# EAGLE design RockSat_PCB (EAGLE 9.6.2)
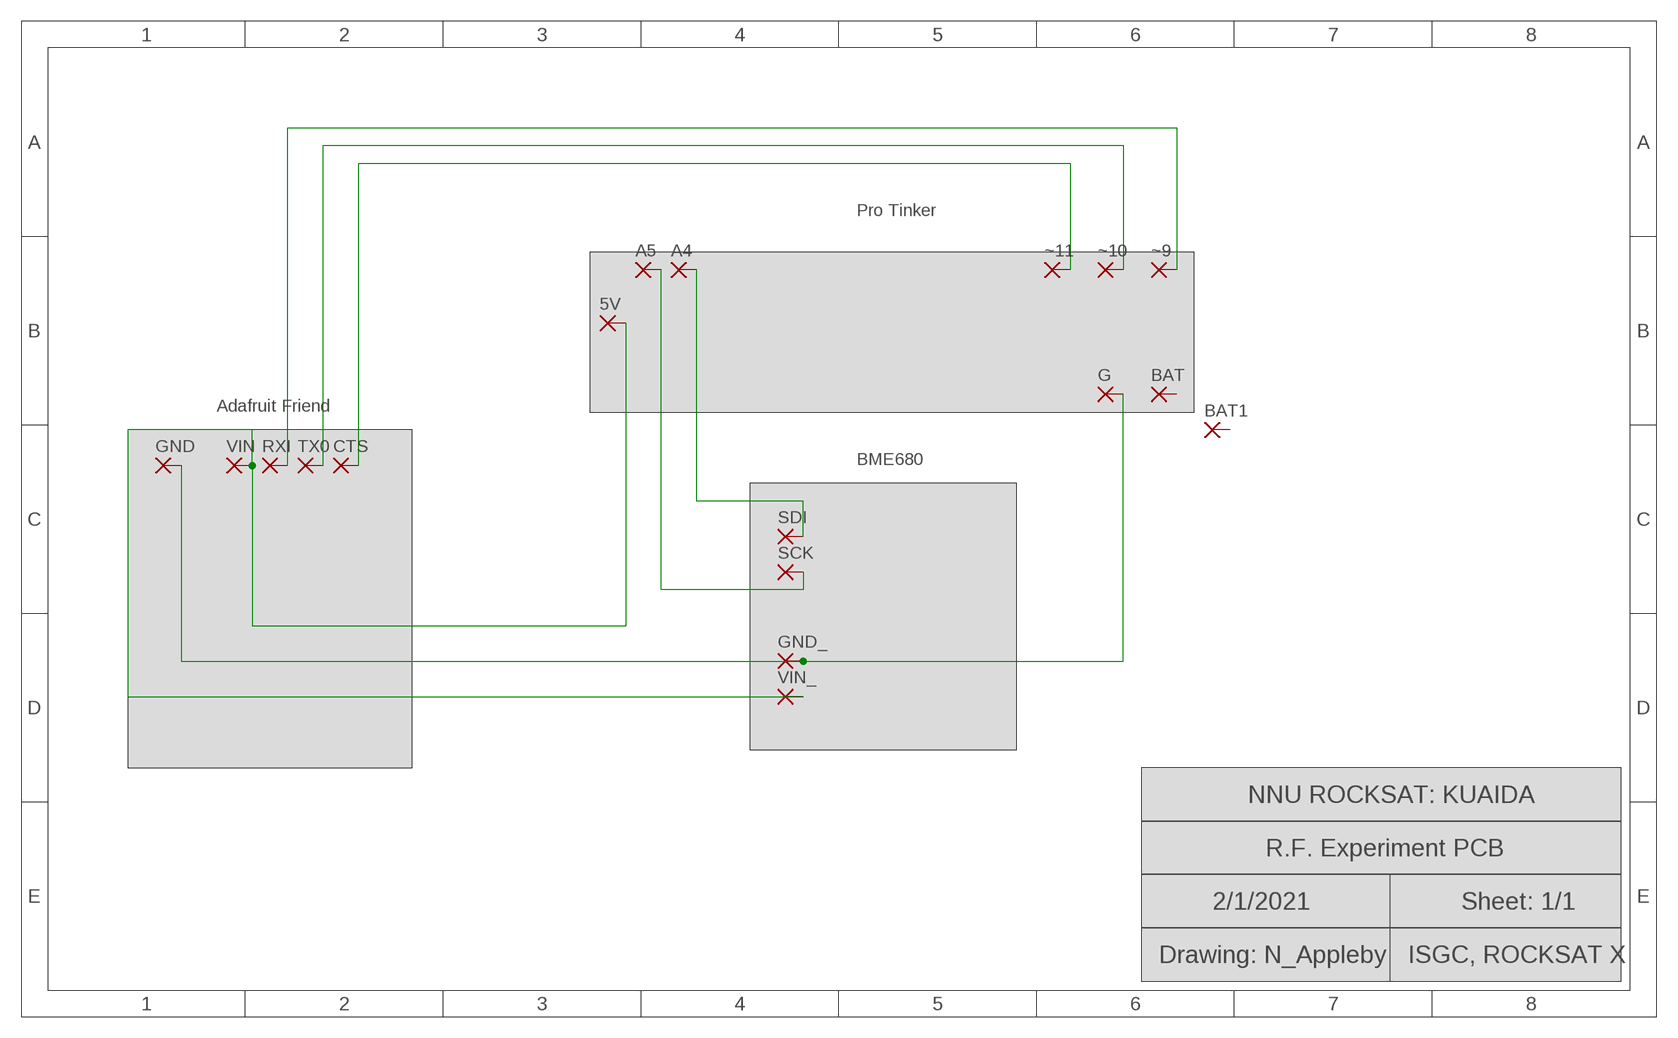
[diagram p0: schematic, sheet 1]

## Parts
5V  1,6/0,9  [1,6/0,9]
A4  1,6/0,9  [1,6/0,9]
A5  1,6/0,9  [1,6/0,9]
BAT  1,6/0,9  [1,6/0,9]
BAT1  1,6/0,9  [1,6/0,9]
CTS  1,6/0,9  [1,6/0,9]
G  1,6/0,9  [1,6/0,9]
GND  1,6/0,9  [1,6/0,9]
GND_  1,6/0,9  [1,6/0,9]
RXI  1,6/0,9  [1,6/0,9]
SCK  1,6/0,9  [1,6/0,9]
SDI  1,6/0,9  [1,6/0,9]
TX0  1,6/0,9  [1,6/0,9]
VIN  1,6/0,9  [1,6/0,9]
VIN_  1,6/0,9  [1,6/0,9]
~9  1,6/0,9  [1,6/0,9]
~10  1,6/0,9  [1,6/0,9]
~11  1,6/0,9  [1,6/0,9]

## Nets
N$1: G.1(P) GND.1(P) GND_.1(P)
N$2: 5V.1(P) VIN.1(P) VIN_.1(P)
N$3: A5.1(P) SCK.1(P)
N$4: RXI.1(P) ~9.1(P)
N$5: TX0.1(P) ~10.1(P)
N$6: CTS.1(P) ~11.1(P)
N$7: A4.1(P) SDI.1(P)
Unconnected: BAT1.1(P) BAT.1(P)

## Notes on the sheet
- Pro Tinker
- Adafruit Friend
- BME680
- NNU ROCKSAT: KUAIDA
- R.F. Experiment PCB
- 2/1/2021 | Sheet: 1/1
- Drawing: N_Appleby | ISGC, ROCKSAT X

## Library data of the parts
5V A4 A5 BAT BAT1 CTS G GND GND_ RXI SCK SDI TX0 VIN VIN_ ~9-~11 = wirepad:1,6/0,9: THROUGH-HOLE PAD

## Board
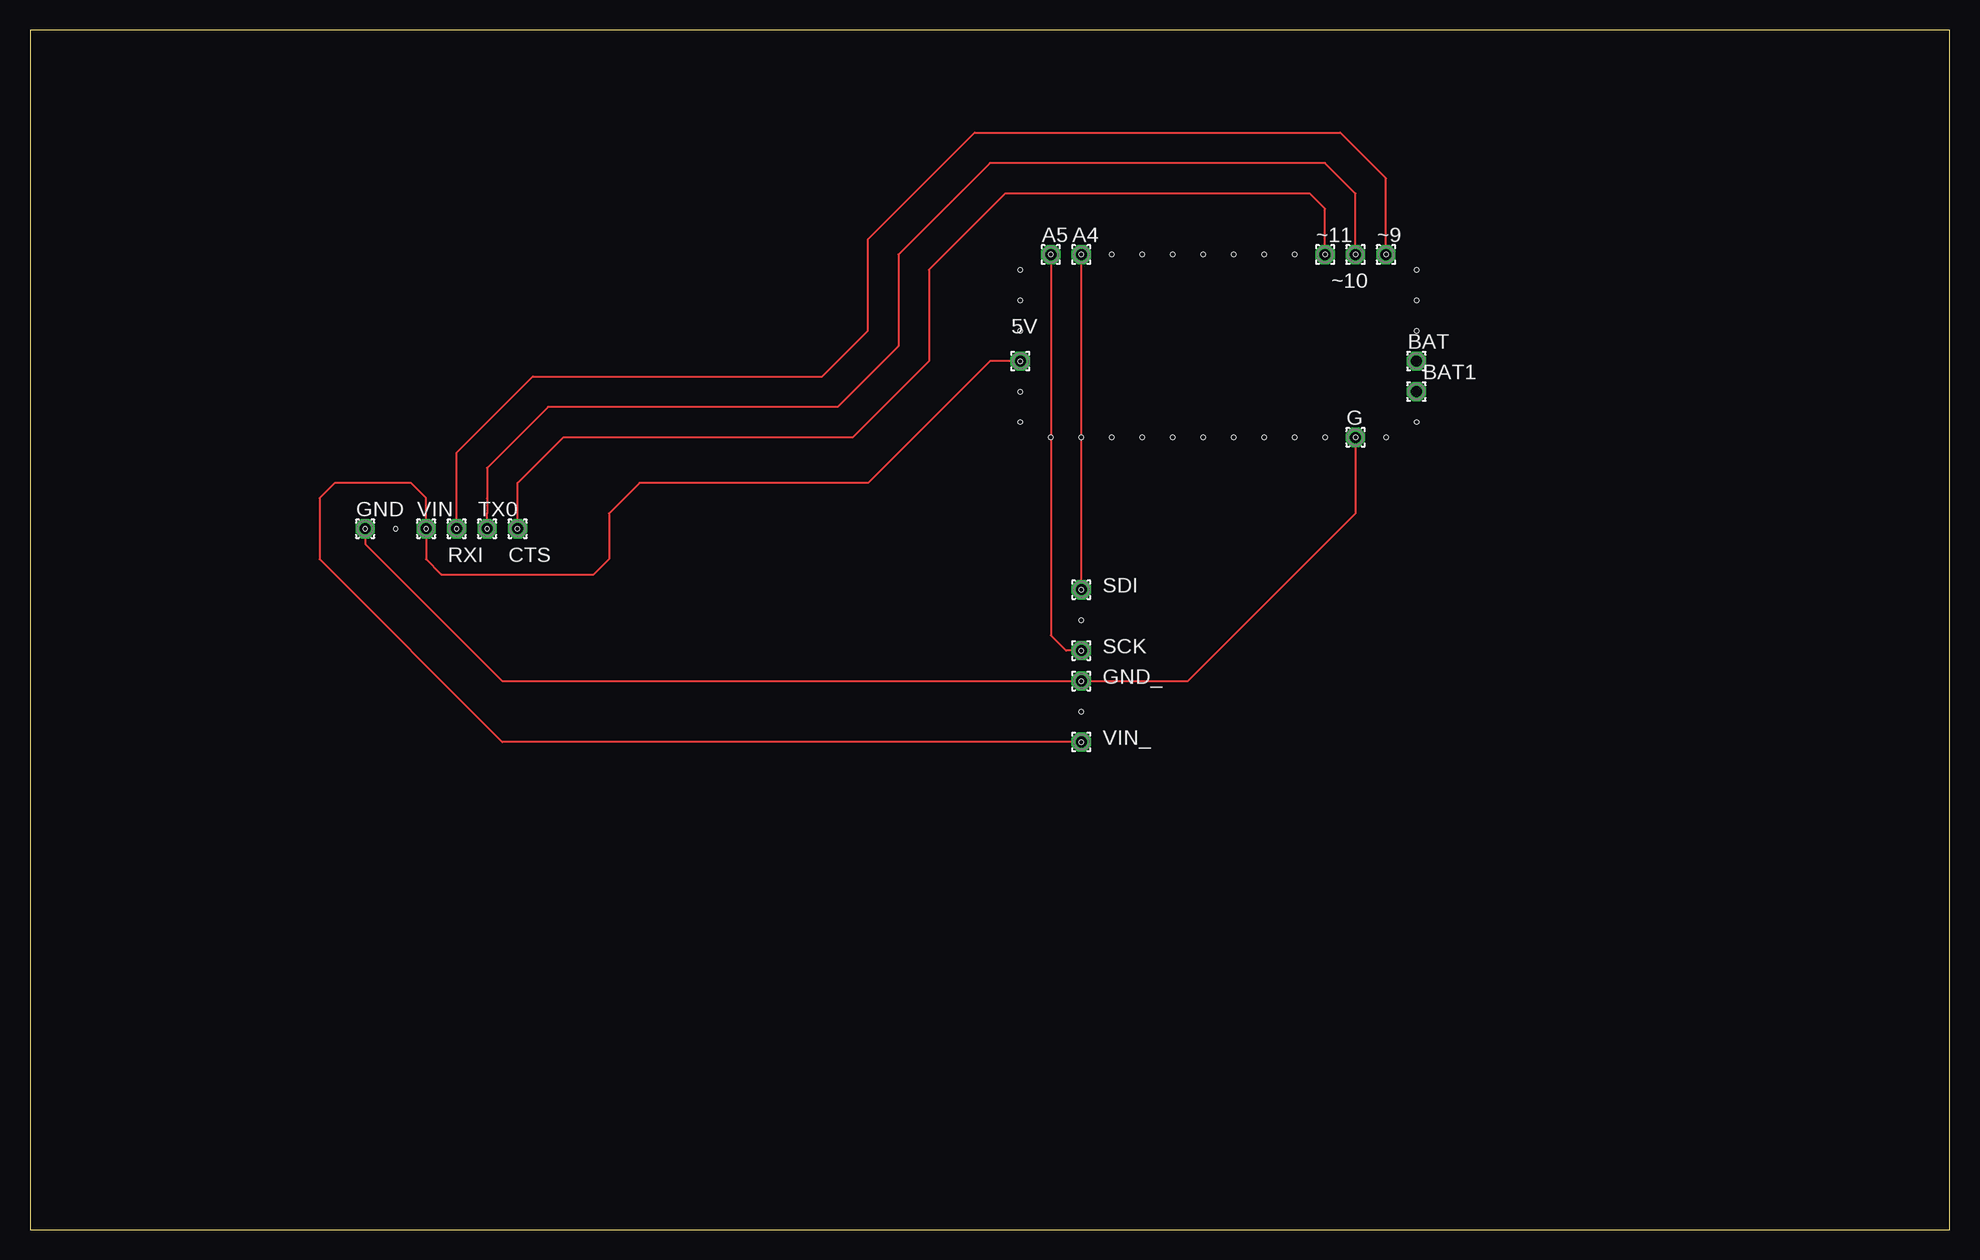
[diagram p1: board, top side]

Size 160 x 100 mm. Coordinates in mm from the lower left corner, seen from the top.
Outline: 0,0 160,0 160,100 0,100 0,0
Copper layers (1*16): Top 0.035mm / dielectric 1.5mm / Bottom 0.035mm
Design rules "default": minimum track width 6mil, minimum drill 0.35mm, track to track 6mil, track to pad 6mil, pad to pad 6mil, via to via 6mil, smd to smd 6mil, copper to edge 40mil, drill to drill 6mil, minimum pad ring 10mil, minimum via ring 8mil, stop-mask expansion 4mil, vias tented up to drill 0mil, thermal gap 10mil
Holes 0.35 mm at 27.94,58.42 33.02,58.42 35.56,58.42 38.1,58.42 40.64,58.42 87.63,53.34 87.63,48.26 87.63,45.72 87.63,40.64 82.55,72.39 85.09,81.28 87.63,81.28 107.95,81.28 110.49,81.28 113.03,81.28 110.49,66.04 90.17,81.28 92.71,81.28 95.25,81.28 97.79,81.28 100.33,81.28 102.87,81.28 105.41,81.28 115.57,74.93 115.57,77.47 115.57,80.01 115.57,67.31 113.03,66.04 107.95,66.04 105.41,66.04 102.87,66.04 100.33,66.04 97.79,66.04 95.25,66.04 92.71,66.04 90.17,66.04 87.63,66.04 85.09,66.04 82.55,67.31 82.55,69.85 82.55,74.93 82.55,77.47 82.55,80.01 87.63,50.8 87.63,43.18 30.48,58.42

### Footprints (pad centres in the part's own frame; a part is rotated, then mirrored left to right if it is on the bottom)
1,6/0,9 = drill 0.914 pad 1.6 octagon: 1 0,0

### Placement (x,y rotation side)
5V  82.55,72.39 0 top
A4  87.63,81.28 0 top
A5  85.09,81.28 0 top
BAT  115.57,72.39 0 top
BAT1  115.57,69.85 0 top
CTS  40.64,58.42 0 top
G  110.49,66.04 0 top
GND  27.94,58.42 0 top
GND_  87.63,45.72 0 top
RXI  35.56,58.42 0 top
SCK  87.63,48.26 0 top
SDI  87.63,53.34 0 top
TX0  38.1,58.42 0 top
VIN  33.02,58.42 0 top
VIN_  87.63,40.64 0 top
~9  113.03,81.28 0 top
~10  110.49,81.28 0 top
~11  107.95,81.28 0 top

### Tracks (layer width: path | path; a pad name or v marks a point on that pad's centre or on a via)
N$1
  Top 0.152: GND.1 27.94,57.15 39.37,45.72 GND_.1 96.52,45.72 110.49,59.69 G.1
N$2
  Top 0.152: VIN_.1 39.37,40.64 24.13,55.88 24.13,60.96 25.4,62.23 31.75,62.23 33.02,60.96 VIN.1 33.02,55.88 34.29,54.61 46.99,54.61 48.26,55.88 48.26,59.69 50.8,62.23 69.85,62.23 80.01,72.39 5V.1
N$3
  Top 0.152: SCK.1 86.36,48.26 85.09,49.53 A5.1
N$4
  Top 0.152: RXI.1 35.56,64.77 41.91,71.12 66.04,71.12 69.85,74.93 69.85,82.55 78.74,91.44 109.22,91.44 113.03,87.63 ~9.1
N$5
  Top 0.152: ~10.1 110.49,86.36 107.95,88.9 80.01,88.9 72.39,81.28 72.39,73.66 67.31,68.58 43.18,68.58 38.1,63.5 38.1,60.96 38.1,59.69 TX0.1
N$6
  Top 0.152: ~11.1 107.95,85.09 106.68,86.36 81.28,86.36 74.93,80.01 74.93,72.39 68.58,66.04 44.45,66.04 40.64,62.23 CTS.1
N$7
  Top 0.152: SDI.1 A4.1